# Altium schematic sheet AudioFrontend.SchDoc
size A4; SheetNumber: 2; SheetTotal: 5
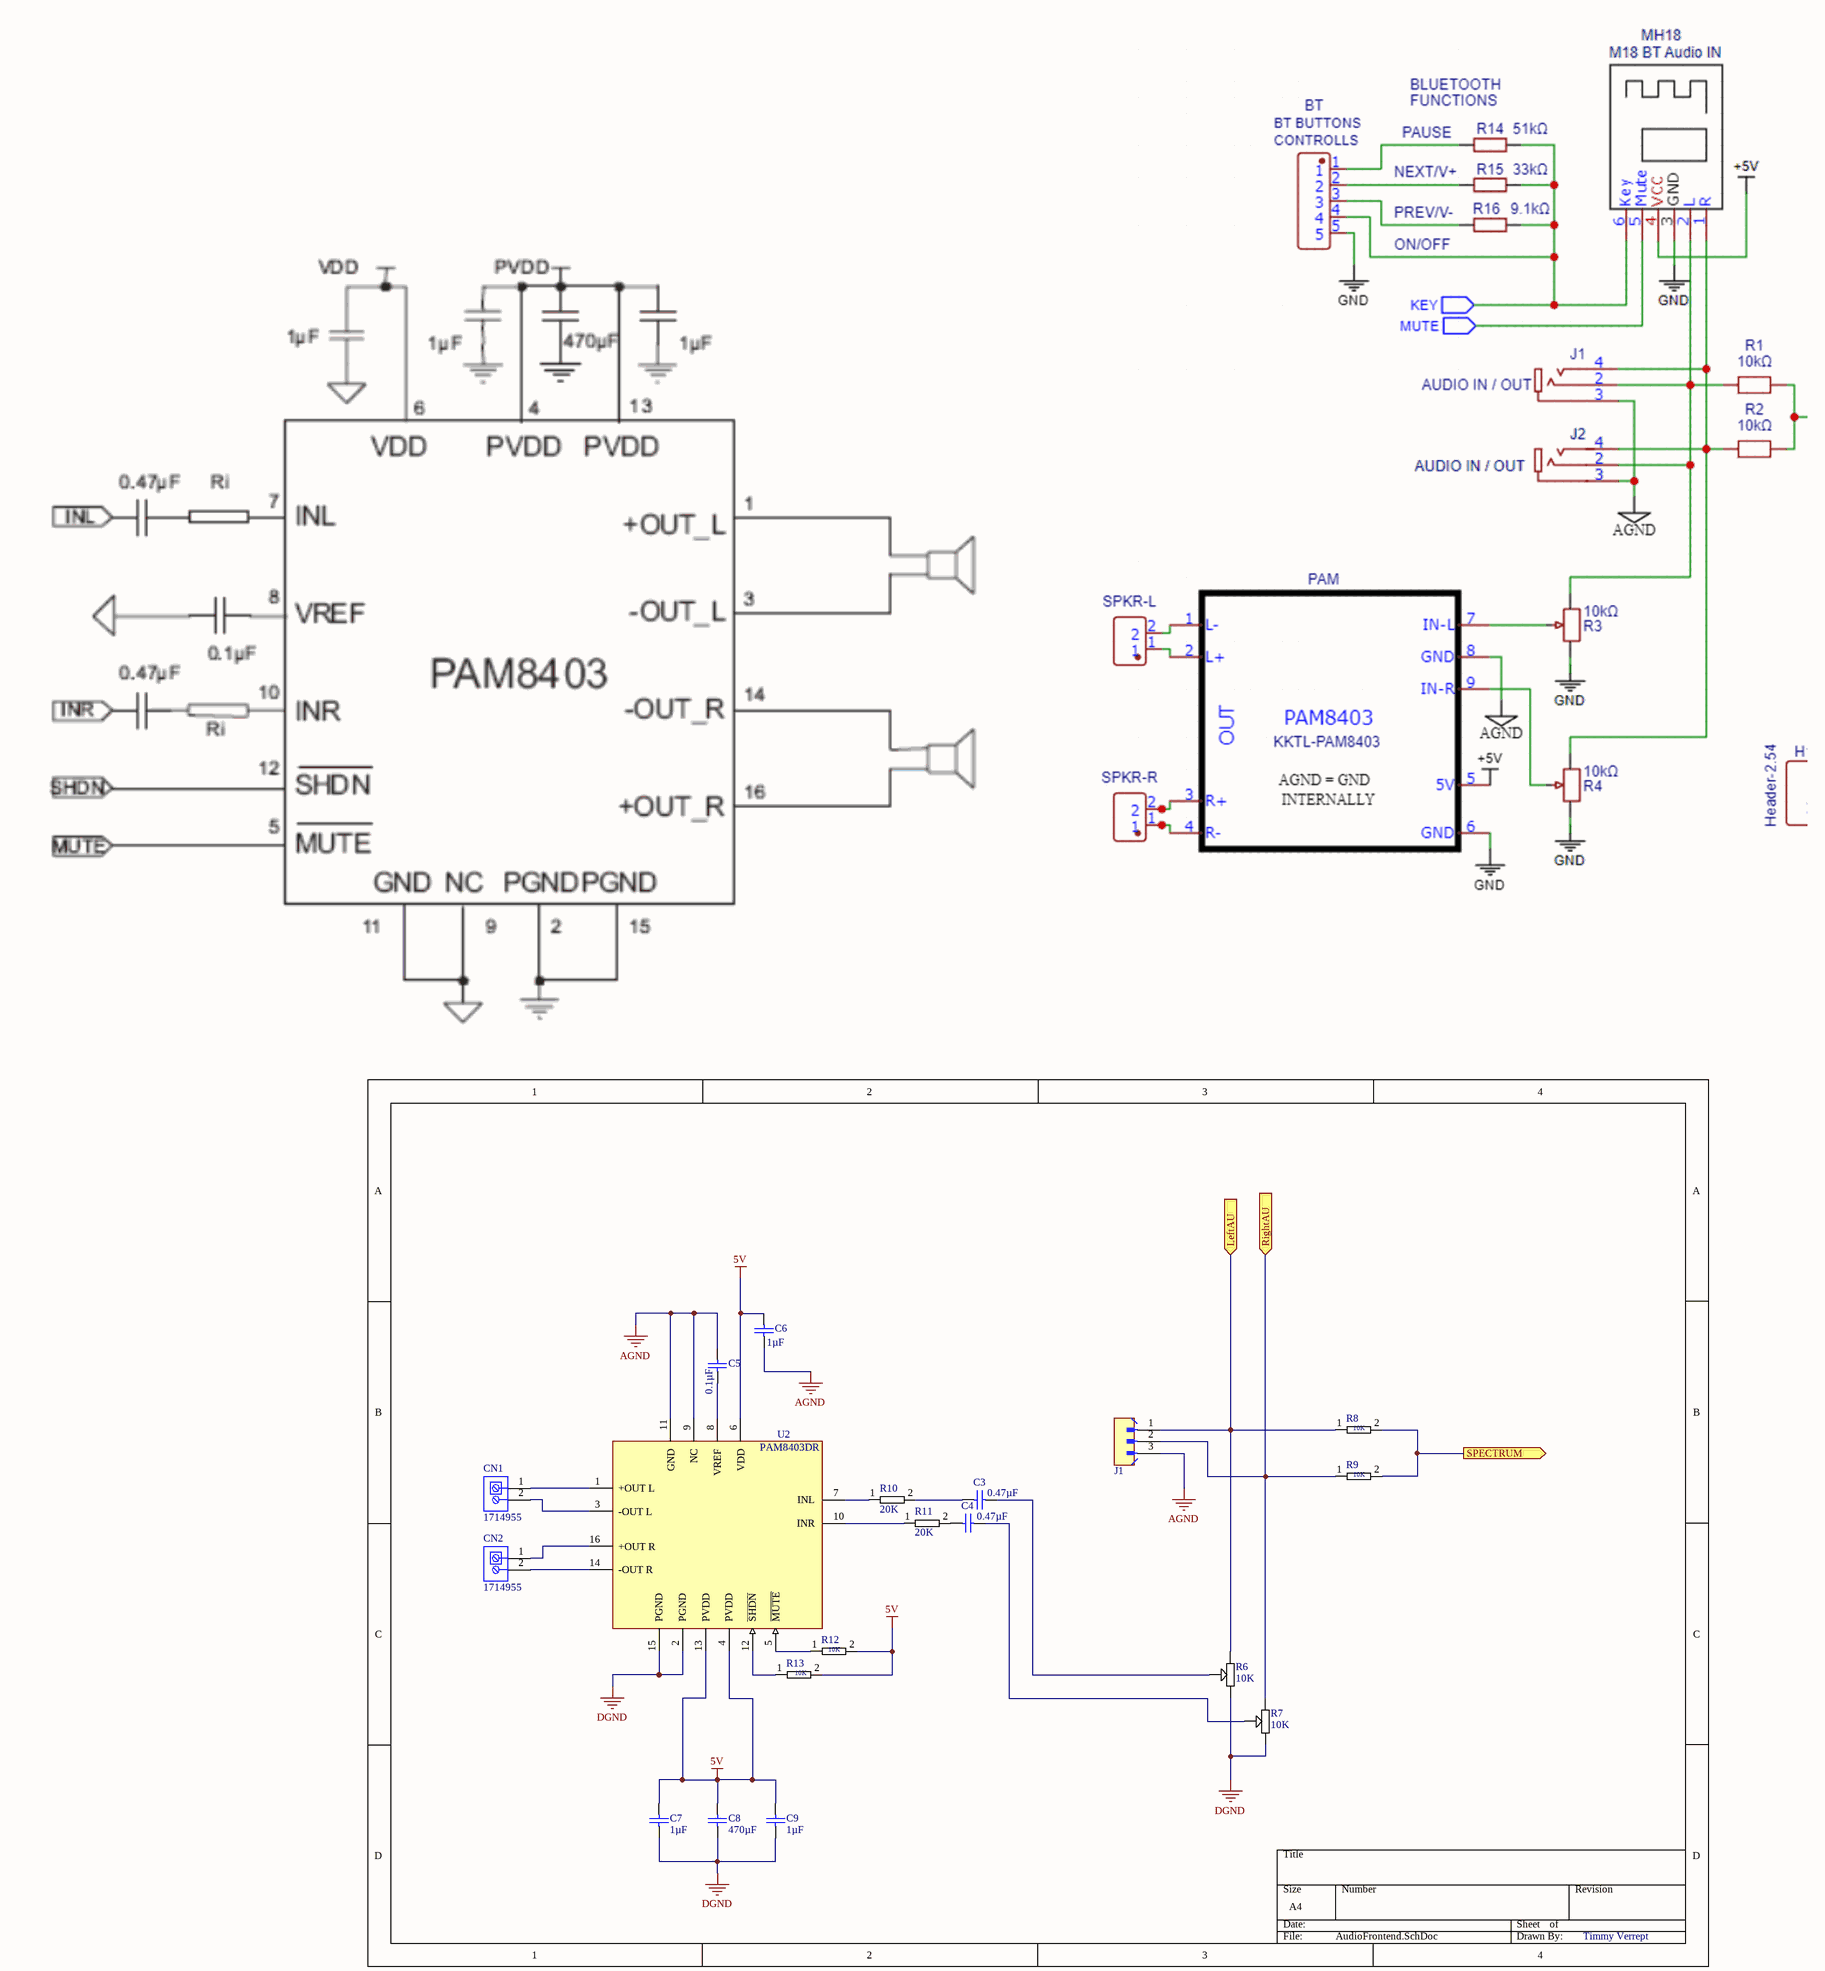
[diagram p0: AudioFrontend.SchDoc]

## Parts
C3  0.47µF  [SMD_CAPACITOR]
C4  0.47µF  [SMD_CAPACITOR]
C5  0.1µF  [SMD_CAPACITOR]
C6  1µF  [SMD_CAPACITOR]
C7  1µF  [SMD_CAPACITOR]
C8  470µF  [SMD_CAPACITOR]
C9  1µF  [SMD_CAPACITOR]
CN1  1714955  [SchroefConnector2P]
CN2  1714955  [SchroefConnector2P]
J1  B3B-PH-K-S  [Connector3P]  (value not drawn)
R6  10K  [POTENTIOMETER]
R7  10K  [POTENTIOMETER]
R8  10K  [SMD_RESISTOR]
R9  10K  [SMD_RESISTOR]
R10  20K  [SMD_RESISTOR]
R11  20K  [SMD_RESISTOR]
R12  10K  [SMD_RESISTOR]
R13  10K  [SMD_RESISTOR]
U2  PAM8403DR  [PAM8403]

## Ports
LeftAU (in, see BluetoothModule[4C]), RightAU (in, see BluetoothModule[4C]), SPECTRUM (out, see SpectrumAnalyzer[1B])

## Nets
5V: C6.1 C7.1 C8.1 C9.1 R12.2 R13.2 U2.4(PVDD) U2.6(VDD) U2.13(PVDD)
AGND: C5.1 C6.2 J1.3 U2.9(NC) U2.11(GND)
DGND: C7.2 C8.2 C9.2 R6.3 R7.3 U2.2(PGND) U2.15(PGND)
LeftAU: J1.1 R6.1 R8.1 ; port LeftAU
RightAU: J1.2 R7.1 R9.1 ; port RightAU
SPECTRUM: R8.2 R9.2 ; port SPECTRUM
NetC3_1: C3.1 R10.2
NetC3_2: C3.2 R6.2
NetC4_1: C4.1 R11.2
NetC4_2: C4.2 R7.2
NetC5_2: C5.2 U2.8(VREF)
NetCN1_1: CN1.1 U2.1(+OUT_L)
NetCN1_2: CN1.2 U2.3(-OUT_L)
NetCN2_1: CN2.1 U2.16(+OUT_R)
NetCN2_2: CN2.2 U2.14(-OUT_R)
NetR10_1: R10.1 U2.7(INL)
NetR11_1: R11.1 U2.10(INR)
NetR12_1: R12.1 U2.5(~{MUTE})
NetR13_1: R13.1 U2.12(~{SHDN})

## Notes on the sheet
- Timmy Verrept

## Library data of the parts
C3-C9 = CER Capacitor: Manufacturer: Vitramon; Part Number: VJ0805Y682KXAMT
CN1 CN2 = schroefconnector 2 pins: PC Terminal Block, Pitch 6.35 mm, 1 x 2 Position, Height 21.5 mm, Tail Lenght 5.1 mm, RoHS, Bulk; Manufacturer: Phoenix Contact; Package Description: PC Terminal Block, Pitch 6.35 mm, 1 x 2 Position, Height 21.5 mm, Tail Lenght 5.1 mm; Datasheet URL: http://media.digikey.com/pdf/Data%20Sheets/Phoenix%20Contact%20PDFs/1714955.pdf; Package Reference: 1714955; Manufacturer URL: http://www.phoenixcontact.com/; Datasheet Version: 02/2010; Mounting Technology: ThroughHole
J1 = Connector_3p: MF: {'manufacturer': u'JST Sales America Inc.'}; Package: None; Price: None; Value: *; MP: B3B-PH-K-S; Availability: Unavailable
R6 R7 = Potmeter: 16mm Rotary Potentiometers / WH148-1A-2-18T-L20; MF: Kls electronics; SnapEDA_Link: https://www.snapeda.com/parts/WH148-1A-2-18T-L20/Kls+electronics/view-part/?ref=snap; Package: Package; Value: *; MP: WH148-1A-2-18T-L20; Check_prices: https://www.snapeda.com/parts/WH148-1A-2-18T-L20/Kls+electronics/view-part/?ref=eda
R8-R13 = Resistor: RES SMD 681 OHM 0.1% 1/8W 0805; Manufacturer: Yageo; Manufacturer Part Number: RT0805BRD07681RL; Value: 681Ω; Temperature Coefficient: 25 ppm/°C; Power Rating: 0.125W; Voltage Rating: 150V; Tolerance: 0.0025; ComponentLink2URL: http://www.yageo.com/documents/recent/PYu-RT_1-to-0.01_RoHS_L_9.pdf; Ipc Land Pattern Name: RESC200125X50; Footprint Url: http://www.yageo.com/exep/pages/download/literatures/PYu-R_Mount_10.pdf; Temperature: -55°C to +155°C; Resistance: 681Ω; Mouser Description: Thin Film Resistors - SMD 1/8W 681 ohm .1% 25ppm; Temperature Range High: +155°C; Device Class L3: Chip SMD Resistors; Automotive: No; Octopart: https://octopart.com/rt0805brd07681rl-yageo-1270194; Device Class L1: Passive Components; Package: RT0805; Device Class L2: Resistors; Category: Res; RoHS: TRUE; Composition: Thin Film; ComponentLink2Description: Datasheet; Temperature Range Low: -55°C; Lead Free: Yes; Digikey Description: RES SMD 681 OHM 0.1% 1/8W 0805; Height: 0.6mm; Series: RT
U2 = Pam8403: IC AMP CLASS D STEREO 3W 16SOP; Manufacturer: Diodes Inc.; Min Supply Voltage: 2.5V; Standoff Height: 0.1mm; Max Junction Temp: +125°C; Number Of Channels: 2; Power At Speaker R: 3.2W @ 4Ω; Nominal Supply Current: 8-16mA; Max Supply Voltage: 5.5V; Package: SO-16; Device Class L3: Amplifiers - Audio; Ipc Land Pattern Name: SOIC127P600X119-16; ComponentLink2URL: https://www.diodes.com/assets/Datasheets/PAM8403.pdf; Automotive: No; ComponentLink2Description: Datasheet; Device Class L1: Integrated Circuits (ICs); Digikey Description: IC AMP CLASS D STEREO 3W 16SOP; Temperature Range High: +85°C; Mouser Description: PAM8403 Series 5.5 V 3 W Filterless Class-D Stereo Audio Amplifier - SOIC-16; RoHS: TRUE; Temperature: -40°C to +85°C; Temperature Range Low: -40°C; Manufacturer Part Number: PAM8403DR; Octopart: https://octopart.com/pam8403dr-diodes+inc.-29030487; Device Class L2: Linear ICs; Category: IC; Footprint Url: https://www.diodes.com/assets/Package-Files/SO-16.pdf; Lead Free: Yes; Height: 1.26mm